# EAGLE design working (EAGLE 9.6.2)
COMPANY: ADAFRUIT INDUSTRIES; DRAWN: KTOWN; REV: A
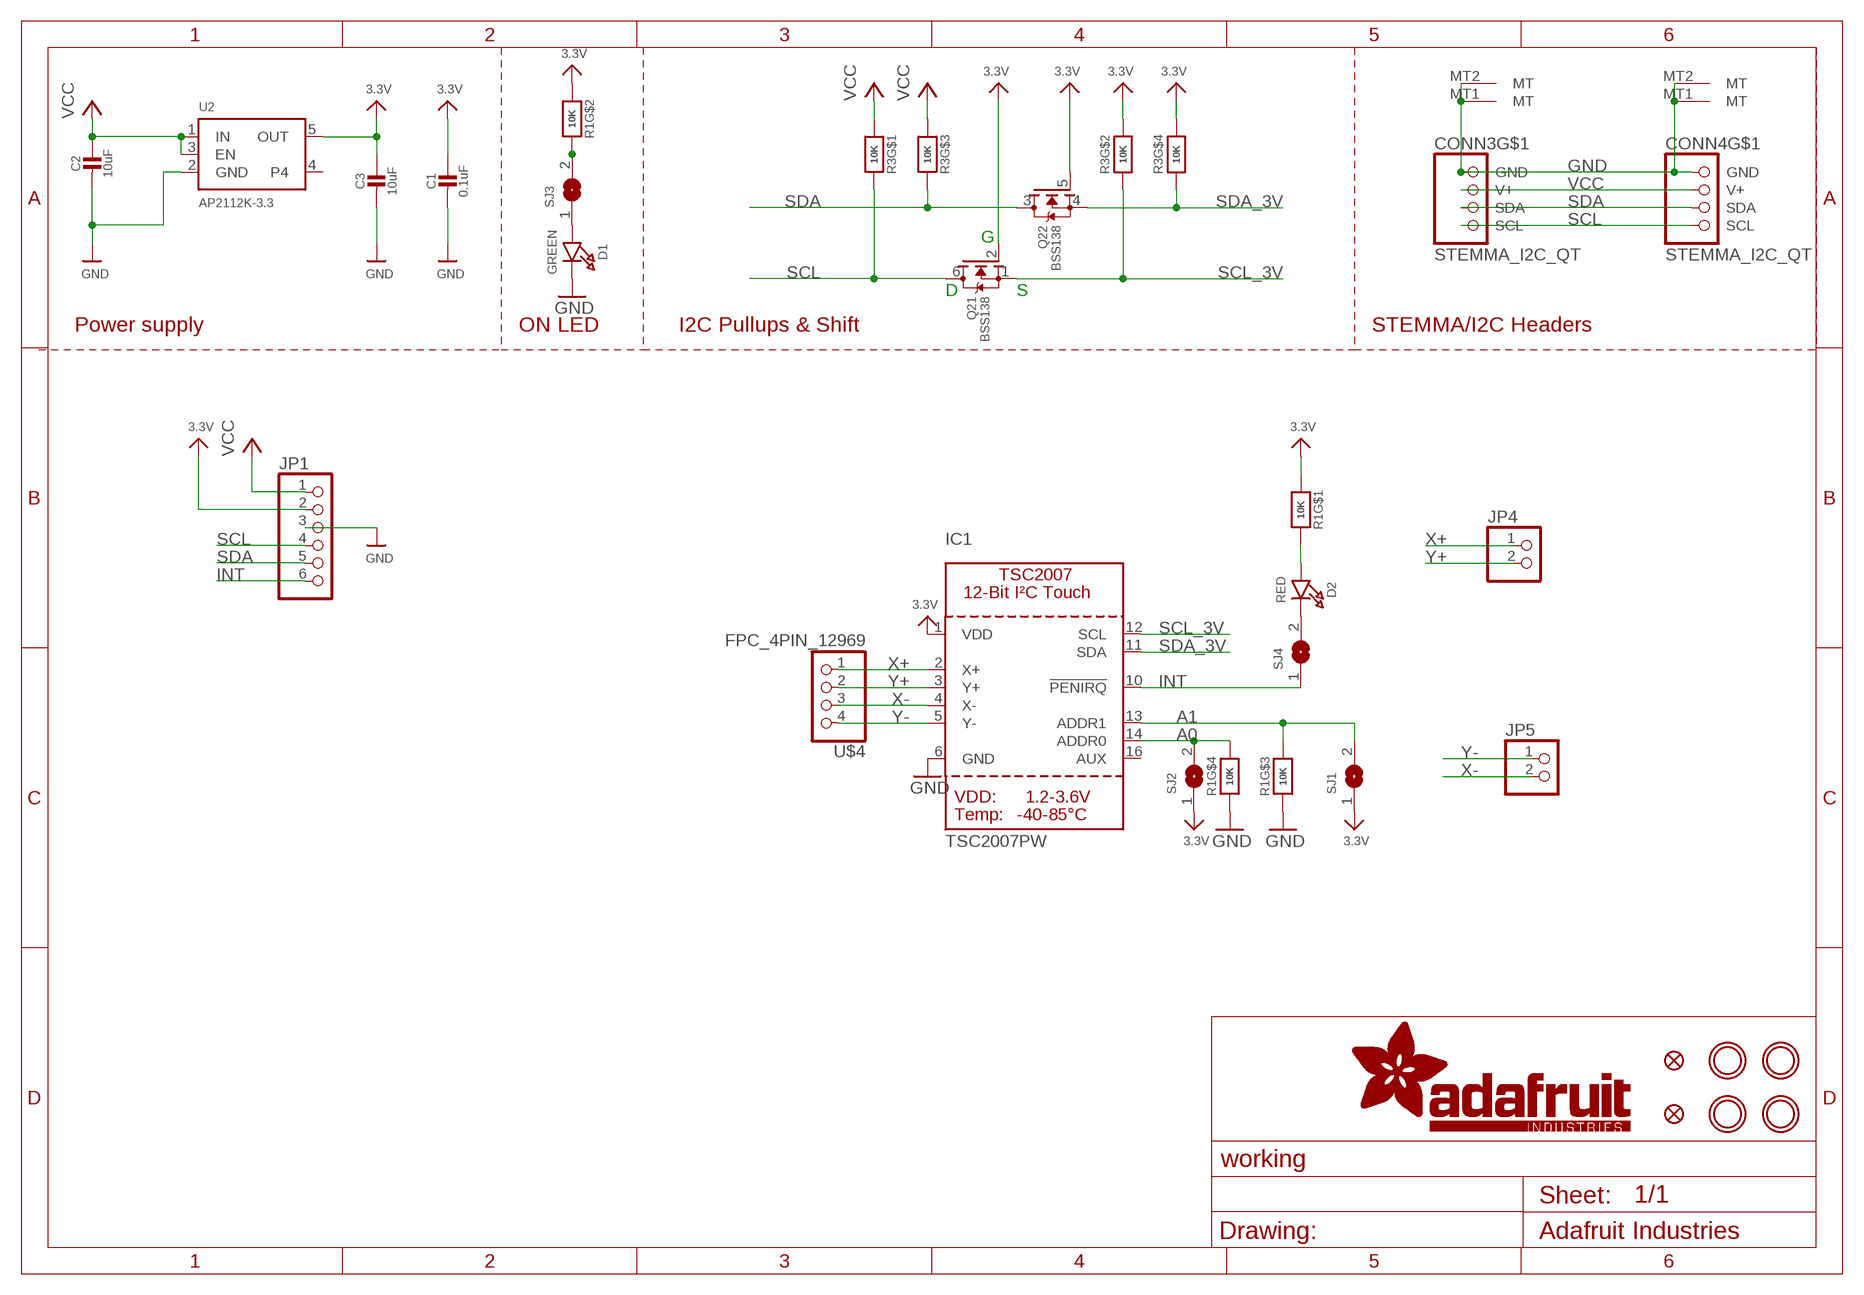
[diagram p0: schematic, sheet 1]

## Parts
C1  0.1uF  CAP_CERAMIC0603_NO  [0603-NO]
C2  10uF  CAP_CERAMIC0805-NOOUTLINE  [0805-NO]
C3  10uF  CAP_CERAMIC0805-NOOUTLINE  [0805-NO]
CONN3  STEMMA_I2C_QT  [JST_SH4]
CONN4  STEMMA_I2C_QT  [JST_SH4]
D1  GREEN  LED0603_NOOUTLINE  [CHIPLED_0603_NOOUTLINE]
D2  RED  LED0603_NOOUTLINE  [CHIPLED_0603_NOOUTLINE]
FID3  FIDUCIAL_1MM  [FIDUCIAL_1MM]
FID4  FIDUCIAL_1MM  [FIDUCIAL_1MM]
IC1  TSC2007PW  [TSSOP16]
JP1  HEADER-1X670MIL  [1X06_ROUND_70]
JP4  HEADER-1X2ROUND  [1X02_ROUND]
JP5  HEADER-1X2ROUND  [1X02_ROUND]
Q2  BSS138  MOSFET-N_DUAL  [SOT363]
R1  10K  RESISTOR_4PACK  [RESPACK_4X0603]
R3  10K  RESISTOR_4PACK  [RESPACK_4X0603]
SJ1  SOLDERJUMPER  [SOLDERJUMPER_ARROW_NOPASTE]
SJ2  SOLDERJUMPER  [SOLDERJUMPER_ARROW_NOPASTE]
SJ3  SOLDERJUMPERCLOSED  [SOLDERJUMPER_CLOSEDWIRE]
SJ4  SOLDERJUMPERCLOSED  [SOLDERJUMPER_CLOSEDWIRE]
U2  AP2112K-3.3  VREG_SOT23-5  [SOT23-5]
U$1  MOUNTINGHOLE2.5  [MOUNTINGHOLE_2.5_PLATED]
U$4  FPC_4PIN_12969  [FPC_CONN_1MM_DUAL_4P]
U$17  MOUNTINGHOLE2.5  [MOUNTINGHOLE_2.5_PLATED]
U$19  MOUNTINGHOLE2.5  [MOUNTINGHOLE_2.5_PLATED]
U$21  MOUNTINGHOLE2.5  [MOUNTINGHOLE_2.5_PLATED]

## Nets
3.3V [lowpower]: C1.1 C3.1 IC1.1(VDD) JP1.2 Q2.2(1:G) Q2.5(2:G) R1.1 R1.2 R3.2 R3.4 SJ1.1 SJ2.1 U2.5(OUT)
A0: IC1.14(ADDR0) R1.5 SJ2.2
A1: IC1.13(ADDR1) R1.6 SJ1.2
GND [highpower]: C1.2 C2.2 C3.2 CONN3.1(GND) CONN3.MT1(MT) CONN3.MT2(MT) CONN4.1(GND) CONN4.MT1(MT) CONN4.MT2(MT) D1.C IC1.6(GND) JP1.3 R1.3 R1.4 U2.2(GND)
INT: IC1.10(!PENIRQ) JP1.6 SJ4.1
N$1: R1.7 SJ3.2
N$2: D1.A SJ3.1
N$3: D2.A R1.8
N$4: D2.C SJ4.2
SCL: CONN3.4(SCL) CONN4.4(SCL) JP1.4 Q2.6(1:D) R3.8
SCL_3V: IC1.12(SCL) Q2.1(1:S) R3.7
SDA: CONN3.3(SDA) CONN4.3(SDA) JP1.5 Q2.3(2:D) R3.6
SDA_3V: IC1.11(SDA) Q2.4(2:S) R3.5
VCC [highpower]: C2.1 CONN3.2(V+) CONN4.2(V+) JP1.1 R3.1 R3.3 U2.1(IN) U2.3(EN)
X+: IC1.2(X+) JP4.1 U$4.1
X-: IC1.4(X-) JP5.2 U$4.3
Y+: IC1.3(Y+) JP4.2 U$4.2
Y-: IC1.5(Y-) JP5.1 U$4.4
Unconnected: IC1.16(AUX) U2.4

## Notes on the sheet
- G
- D | S
- Power supply | ON LED | I2C Pullups & Shift | STEMMA/I2C Headers

## Library data of the parts
C1-C3 = microbuilder:CAP_CERAMIC: Ceramic Capacitors For new designs, use the packages preceded by an '_' character since they are more reliable: The following footprints should be used on most boards: _0402 - Standard footprint for regular board layouts _0603 - Standard footprint for regular board layouts _0805 - Standard footprint for regular board layouts _1206 - Standard footprint for regular board layouts For extremely tight-pitch boards where space is at a premium, the following 'micro-pitch' footprints can be used (smaller pads, no silkscreen outline, etc.): _0402MP - Micro-pitch footprint for very dense/compact boards _0603MP - Micro-pitch footprint for very dense/compact boards _0805MP - Micro-pitch footprint for very dense/compact boards _1206MP - Micro-pitch footprint for very dense/compact boards
CONN3 CONN4 = microbuilder:STEMMA_I2C
D1 D2 = microbuilder:LED: LED 0603 - 0603 Surface Mount Package 2mA: Green LED - Low Power (3.9mcd, 2ma, 1.7Vf) - Digikey: 475-2709-2-ND Orange LED - Low Power (9.8mcd, 2ma, 1.8Vf) - Digikey: 475-1194-2-ND Red LED - Low Power (5mcd, 2ma, 1.8Vf) - Digikey: 475-1195-2-ND Yellow LED - Low Power (7mcd, 2ma, 1.8Vf) - Digikey: 475-1196-2-ND 5mA: Blue LED - Low Power (17mcd, 5ma, 2.9Vf) - Digikey: LNJ937W8CRACT-ND 0805 - 0805 Surface Mount Package 2mA: Red LED (8.8mcd, 2mA, 1.8Vf, Clear) - Low Power [Digikey: 475-2510-1-ND] Green LED (5mcd, 2mA, 1.8Vf, Clear) - Low Power [Digikey: 475-2730-1-ND] Yellow LED (11.3mcd, 2mA, 1.8Vf, Clear) - Low Power [Digikey: 475-2555-1-ND] 20mA: Red LED (104mcd, 20mA, Diffused) - LS R976 [Digikey: 475-1278-6-ND] Red LED (12mcd, 20mA, 2.0Vf, Clear) - APT2012EC [Digikey: 754-1128-1-ND] Green LED (15mcd, 20mA, 2.2Vf, Clear) - APT2012GC [Digikey: 754-1131-1-ND] Orange LED (160mcd, 20mA, 2.1Vf, Clear) - APT2012SECK [Digikey: 754-1130-1-ND] 1206 - 1206 Surface Mount Package Green LED (26mcd, 20mA, Diffused) - LG N971 [Digikey: 475-1407-6-ND] Red LED (15mcd, 20mA, Diffused) - LH N974 [Digikey: 475-1416-6-ND] Cree - Cree High-Power Surface Mount LEDs XPEBWT-L1-0000-00D50 - White 111lm 350mA 2.9Vf 6200K 110° XTEAWT-00-0000-00000LEE3 - White 114lm 350mA 2.85Vf 5000K 115° Everlight - Everlight 45-21 Series Surface Mount LEDs 45-21/QK2C-B2832AC2CB2/2T - Warm White 2000mcd 20mA 3.25Vf 3050K 120° 45-21/LK2C-B38452C4CB2/2T - Nuetral White 2000mcd 20mA 3.25Vf 4150K 120° 45-21/LK2C-B50634C6CB2/2T - Cold White 2200mcd 20mA 3.25Vf 5650K 120° PLCC2 Reverse Mount LS T77K-J1L2-1-0-2-R18-Z - Red 11.25mcd 2mA 1.8Vf 630nm 120° LO T77K-L1M2-24-Z - Orange 19.6mcd 2mA 1.8Vf 606nm 120° LY T77K-K2M1-26-Z - Yellow 15.7mcd 2mA 1.8Vf 587nm 120°
FID3 FID4 = microbuilder:FIDUCIAL: Fiducial Alignment Points Various fiducial points for machine vision alignment.; BOM: EXCLUDE
IC1 = adafruit_sensor:TSC2007
JP1 = microbuilder:HEADER-1X6: PIN HEADER
JP4 JP5 = microbuilder:HEADER-1X2: PIN HEADER
Q2 = microbuilder:MOSFET-N_DUAL: Dual N-Channel MOSFET SOT363 (2.0x1.25mm) 2N7002PS - 60V, 320mA [Digikey: 568-5984-1-ND]
R1 R3 = microbuilder:RESISTOR_4PACK: Resistor Packs (4 resistors) 4 x 0603 10K 1/16W - Digikey: YC164J-10KCT-ND
SJ1 SJ2 = microbuilder:SOLDERJUMPER: SMD Solder JUMPER Solder the two pads together to create a connection, or remove the solder to break it. REFLOW - Use this footprint for solder paste and reflow ovens. WAVE - Use this footprint for hand-soldering (larger pads). CLOSED - Has a trace between the two pads to ensure it is closed by default. The trace needs to be cut to disable the jumper, and can be closed again by creating a solder bridge between the two pads.; BOM: EXCLUDE
SJ3 SJ4 = microbuilder:SOLDERJUMPER: SMD Solder JUMPER Solder the two pads together to create a connection, or remove the solder to break it. REFLOW - Use this footprint for solder paste and reflow ovens. WAVE - Use this footprint for hand-soldering (larger pads). CLOSED - Has a trace between the two pads to ensure it is closed by default. The trace needs to be cut to disable the jumper, and can be closed again by creating a solder bridge between the two pads.
U2 = adafruit_power:VREG_SOT23-5: SOT23-5 Fixed Voltage Regulators Part Current Out V Out V In V Dropout θJA (°C/W) TJ (°C) Digikey Part No. ADP121 150mA 3.3V 3.4-5.5V 0.09V @ 150mA -- -- ADP121-AUJZ33R7CT-ND ADP121 150mA 3.0V 3.1-5.5V 0.09V @ 150mA -- -- ADP121-AUJZ30R7CT-ND ADP122 300mA 3.3V 3.4-5.5V 0.085V @ 300mA -- -- ADP122AUJZ-3.3-R7CT-ND ADP1712 300mA 3.3V 3.5-5.5V 0.17V @ 300mA -- -- ADP1712AUJZ-3.3-R7TR-ND AP7311 (Low Cost) 150mA 3.3V 3.5-6V 0.15V @ 150mA -- -- AP7311-33WG-7DICT-ND LD39015M18R 150mA 1.8V 1.9V-5.5V 0.08V @ 100mA -- -- 497-6977-1-ND LP2985A-33DBVR 150mA 3.3V 3.3-16V 0.28V @ 150mA 206 150 296-18479-1-ND MCP1824T-3302E/OT 300mA 3.3V 3.5V-6V 0.2V @ 300mA -- -- MCP1824T-3302E/OTCT-ND MIC5205-2.5YM5 TR 150mA 2.5V 2.7-16V 0.165V @ 150mA -- -- 576-1257-2-ND MIC5205-3.0YM5 TR 150mA 3.0V 3.2V-16V 0.165V @ 150mA -- -- 576-1258-2-ND MIC5205-3.3YM5 TR 150mA 3.3V 3.5V-16V 0.165V @ 150mA -- -- 576-1259-2-ND TPS780330220 150mA 3.3V+2.2V 3.6-5.5V 250mV Max -- -- 296-23332-1-ND TDA3663/N1,135 100mA 3.3V 3.5-45V 0.18V @ 50mA -- -- 568-5343-1-ND Max operating temp can be calculated using θJA, TJ (max junction temperature), and power in watts. Set the "Maximum Ambient Temperature" until it reaches TJ ("Max Junction Temperature"), which is the absolute limit for safe use of the regulator: Heat Sink Temperature Calculator <http://www.daycounter.com/Calculators/Heat-Sink-Temperature-Calculator.phtml> For example, With 12V source into a 3.3V LP2985 and a 30mA load, we are dissipating (12V-3.3V) * 0.03A = 0.261W. With a θJA of 206 °C/W, a TJ of 150°C, and 261mW we can safely use the chip without a heat sink up to 75°C (=147.1°C Junction Temperature).
U$1 U$17 U$19 U$21 = adafruit_electromech:MOUNTINGHOLE: Mounting Hole For #2 screws (0.086"/2.18mm width, 0.094"/2.4mm hole) use 2.5mm; BOM: EXCLUDE
U$4 = microbuilder:FPC_4PIN

## Net classes
1 highpower: width 0.305 mm, drill 0.483 mm
2 lowpower: width 0.254 mm, drill 0.483 mm

## Board
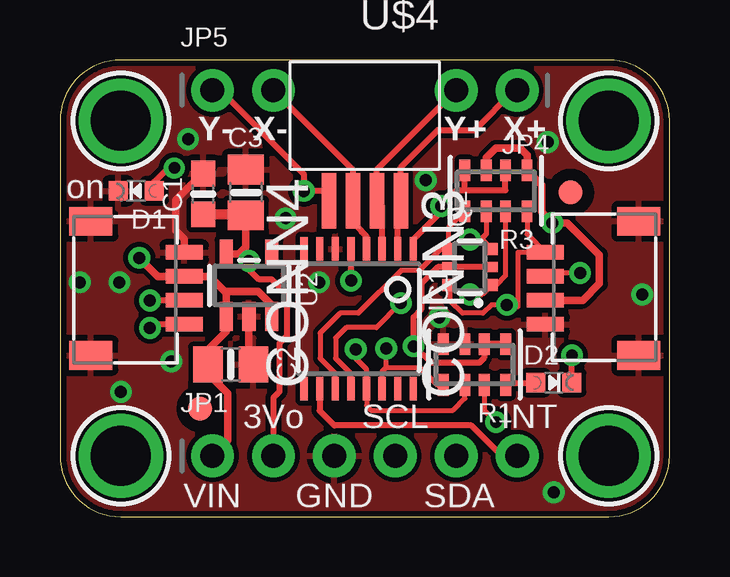
[diagram p1: board, top side]
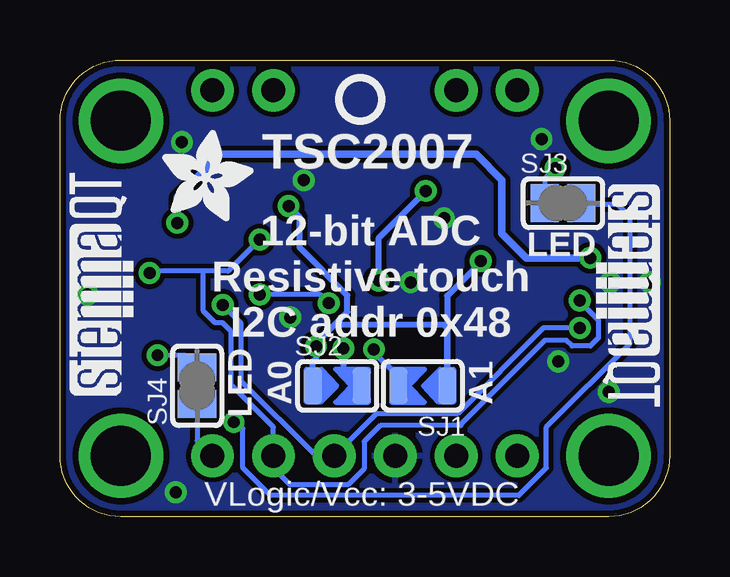
[diagram p2: board, bottom side, seen from below]

Size 25.4 x 19.05 mm. Coordinates in mm from the lower left corner, seen from the top.
Outline: 0,16.51 0,2.54 arc90 2.54,0 22.86,0 arc90 25.4,2.54 25.4,16.51 arc90 22.86,19.05 2.54,19.05 arc90 0,16.51
Copper layers (1*16): Top 0.035mm / dielectric 1.5mm / Bottom 0.035mm
Design rules "adafruit *": minimum track width 8mil, minimum drill 15.5mil, track to track 8mil, track to pad 8mil, pad to pad 8mil, via to via 8mil, smd to smd 8mil, copper to edge 10mil, drill to drill 8mil, minimum pad ring 10mil, minimum via ring 8mil, stop-mask expansion 2mil, vias tented up to drill 20mil, thermal gap 10mil

### Footprints (pad centres in the part's own frame; a part is rotated, then mirrored left to right if it is on the bottom)
0603-NO = smd 1.075 x 1: 1 -0.85,0; 2 0.85,0
0805-NO = smd 1.24 x 1.5: 1 -0.95,0; 2 0.95,0
JST_SH4 = smd 0.6 x 1.55: 1 -1.5,2.514; 2 -0.5,2.514; 3 0.5,2.514; 4 1.5,2.514 | smd 1.2 x 1.8: MT1 -2.8,-1.386; MT2 2.8,-1.386
CHIPLED_0603_NOOUTLINE = smd 0.8 x 0.8: A 0,-0.75; C 0,0.75
FIDUCIAL_1MM = smd 1 x 1: 1 0,0
TSSOP16 = smd 0.305 x 0.991: 1 -2.275,-2.918; 2 -1.625,-2.918; 3 -0.975,-2.918; 4 -0.325,-2.918; 5 0.325,-2.918; 6 0.975,-2.918; 7 1.625,-2.918; 8 2.275,-2.918; 9 2.275,2.918; 10 1.625,2.918; 11 0.975,2.918; 12 0.325,2.918; 13 -0.325,2.918; 14 -0.975,2.918; 15 -1.625,2.918; 16 -2.275,2.918
1X06_ROUND_70 = drill 1 pad 1.778: 1 -6.35,0; 2 -3.81,0; 3 -1.27,0; 4 1.27,0; 5 3.81,0; 6 6.35,0
1X02_ROUND = drill 1 pad 1.778: 1 -1.27,0; 2 1.27,0
SOT363 = smd 0.5 x 0.5: 1 -0.75,-0.9; 3 0.75,-0.9; 4 0.75,0.9; 6 -0.75,0.9 | smd 0.4 x 0.5: 2 0,-0.9; 5 0,0.9
RESPACK_4X0603 = smd 0.45 x 0.9: 1 -1.3,-0.85; 2 -0.4,-0.85; 3 0.4,-0.85; 4 1.3,-0.85; 5 1.3,0.85; 6 0.4,0.85; 7 -0.4,0.85; 8 -1.3,0.85
SOLDERJUMPER_ARROW_NOPASTE = smd 0.762 x 1.524: 1 -1.016,0; 2 1.016,0
SOLDERJUMPER_CLOSEDWIRE = smd 1.168 x 1.6: 1 -0.762,0; 2 0.762,0 | smd 0.635 x 0.203: WIRE 0,0
SOT23-5 = smd 0.55 x 1.2: 1 -0.95,-1.3; 2 0,-1.3; 3 0.95,-1.3; 4 0.95,1.3; 5 -0.95,1.3
MOUNTINGHOLE_2.5_PLATED = drill 2.5 pad 3.2: P$1 0,0
FPC_CONN_1MM_DUAL_4P = smd 0.6 x 2.3: 1 -1.5,1.3; 2 -0.5,1.3; 3 0.5,1.3; 4 1.5,1.3

### Placement (x,y rotation side)
C1  5.97,13.46 90 top
C2  7.11,6.35 0 top
C3  7.75,13.53 90 top
CONN3  22.73,9.53 90 top
CONN4  2.67,9.53 270 top
D1  3.17,13.59 90 top
D2  20.57,5.59 270 top
FID3  5.84,4.51 0 top
FID4  21.27,13.53 0 top
IC1  12.45,8.26 180 top
JP1  12.7,2.54 0 top
JP4  17.78,17.78 180 top
JP5  7.62,17.78 0 top
Q2  17.08,10.41 90 top
R1  17.27,6.35 180 top
R3  18.16,13.59 180 top
SJ1  10.29,5.46 180 bottom
SJ2  13.84,5.46 0 bottom
SJ3  4.45,13.08 0 bottom
SJ4  19.68,5.46 90 bottom
U2  7.87,9.65 0 top
U$1  2.54,16.51 0 top
U$4  12.7,14.48 180 top
U$12  [ADAFRUIT_3.5MM]  21.15,12.32 0 bottom
U$17  22.86,16.51 0 top
U$19  2.54,2.54 0 top
U$21  22.86,2.54 0 top
U$25  [PCBFEAT-REV-040]  12.89,17.4 0 bottom
U$30  [STEMMAQT]  22.35,5.08 90 bottom
U$31  [STEMMAQT]  3.05,13.84 270 bottom

### Tracks (layer width: path | path; a pad name or v marks a point on that pad's centre or on a via)
3.3V  (via drill 0.5)
  Top 0.254: R3.2 18.56,13.62 16.86,13.62 | Q2.2 Q2.5 15.75,10.41 15.05,9.72 15.05,8.64 14.73,8.32 v14.73,7.11 14.79,7.11 15.48,6.42 17.47,6.42 17.67,6.62 R1.2 R1.1 | C3.1 7.75,10.79 v7.87,10.67 7.87,10.31 8.29,9.89 8.81,9.89 9.46,9.25 9.46,7.56 9.14,7.23 9.14,5.21 8.89,4.96 JP1.2 | IC1.1 14.72,11.55 16,12.83 v15.88,12.95 15.88,12.96 16.53,13.62 16.86,13.62 | 16.86,13.62 R3.4
  Top 0.305: U2.5 7.46,10.95 7.75,11.24 C3.1
  Top 0.406: C3.1 7.71,12.61 C1.1
  Bottom 0.254: SJ2.1 14.86,6.48 14.73,6.6 v14.73,7.11 14.73,7.24 13.97,8 | v15.88,12.95 15.43,12.51 15.43,11.24 13.42,9.23 13.42,8.55 13.97,8 | v7.87,10.67 7.87,10.6 9.27,9.21 SJ1.1 9.27,7.87 9.4,8 13.97,8
A0  (via drill 0.5)
  Top 0.203: IC1.14 13.42,6.05 13.59,6.22 | 13.59,6.22 14.99,6.22 15.71,5.5 R1.5 | 13.59,6.22 v13.59,7.02
  Bottom 0.254: v13.59,7.02 13.59,6.22 SJ2.2
A1  (via drill 0.5)
  Top 0.203: v12.32,6.99 12.32,6.6 12.77,6.15 IC1.13 12.77,4.63 12.95,4.45 16.38,4.45 16.87,4.93 R1.6
  Bottom 0.254: v12.32,6.99 12.32,6.86 11.3,5.84 SJ1.2
GND  (via drill 0.5)
  Top 0.305: 19.91,8 19.86,8 19.89,8.03 CONN3.1 | U2.2 7.87,6.54 C2.2 | C1.2 5.93,14.31 4.83,13.21 4.83,11.94 5.18,11.58 CONN4.1
  other vias: 24.26,9.27 0.83,9.78 10.79,9.78 9.4,12.45 5.33,15.75 20.32,15.62 20.57,1.02 2.54,5.21 15.24,14.03 15.81,8.32 2.48,9.78 4.64,6.48
  pour Top: 0,19.05 25.4,19.05 25.4,0 0,0
  pour Bottom: 0,19.05 25.4,19.05 25.4,0 0,0
INT
  Top 0.254: IC1.10 10.82,4.42 11.43,3.81 17.14,3.81 18.41,2.54 JP1.6
  Bottom 0.203: SJ4.1 19.68,3.17 JP1.6
N$1  (via drill 0.48)
  Top 0.203: R1.7 17.67,4.44 v18.16,3.95
  Bottom 0.203: SJ3.2 3.56,12.95 3.49,13.02 2.16,13.02 1.65,12.51 1.65,7.23 5.13,3.75 5.13,2.04 6.28,0.89 16.64,0.89 17.78,2.03 17.78,3.68 18.05,3.95
  Bottom 0.254: v18.16,3.95 18.05,3.95
N$2  (via drill 0.48)
  Top 0.254: D1.A 3.92,13.96 4.51,14.54 v4.76,14.54
  Bottom 0.203: v4.76,14.54 5.21,14.1 SJ3.1
N$3
  Top 0.254: R1.8 18.66,5.59 D2.A
N$4  (via drill 0.48)
  Top 0.254: D2.C 21.32,6.72 v21.34,6.73
  Bottom 0.203: SJ4.2 20.19,6.73 v21.34,6.73
SCL  (via drill 0.5)
  Top 0.203: Q2.6 16.25,9.6 16.25,9.02 16.77,8.49 17.63,8.49 17.99,8.84 v18.62,8.84 18.7,8.76 19.08,8.76 19.08,11.03 CONN3.4 19.46,11.78 R3.8
  Top 0.254: CONN4.4 3.9,8.03 v3.75,7.87
  Bottom 0.203: v3.75,7.87 5.26,7.87 8.81,4.32 12.19,4.32 JP1.4 14.73,2.54 17.86,5.67 17.86,8.08 v18.62,8.84
SCL_3V  (via drill 0.5)
  Top 0.203: 12.12,5.97 11.49,6.61 11.49,7.46 11.92,7.89 13.19,7.89 v14.21,8.91 | v17.08,9.27 17.59,9.27 Q2.1 18.17,9.66 18.56,10.05 R3.7
  Top 0.254: IC1.12 12.12,5.97
  Bottom 0.203: v17.08,9.27 17.06,9.29 14.59,9.29 v14.21,8.91
SDA  (via drill 0.5)
  Top 0.203: Q2.3 17.59,11.56 v17.08,11.56 17.53,11.56 17.76,11.79 R3.6 | v21.67,10.16 20.73,10.16
  Top 0.254: 20.73,10.16 20.6,10.03 CONN3.3 | CONN4.3 v3.75,9.03 v3.75,9.02
  Bottom 0.203: v3.75,9.02 3.75,8.98 2.96,8.2 2.96,7.45 3.3,7.12 4.06,7.12 4.3,7.36 5.2,7.36 8.7,3.86 8.7,3.81 12.05,3.81 12.72,3.14 12.72,2.01 13.4,1.33 15.81,1.33 16.51,2.03 | v21.67,10.16 21.42,10.16 21.34,10.24 19.43,10.24 | v17.08,11.56 18.4,10.24 19.43,10.24 | 19.43,10.24 19.43,8.58 18.93,8.08 18.62,8.08 18.27,7.72 18.27,5.5 16.51,3.74 JP1.5
  Bottom 0.254: 16.51,2.03 JP1.5
SDA_3V
  Top 0.203: R3.5 16.18,12.06 Q2.4 15.86,11.16 14.97,10.28 14.21,10.28 12.44,8.5 11.67,8.5 10.84,7.66 10.84,6.61 11.47,5.97 IC1.11
VCC  (via drill 0.5)
  Top 0.305: JP1.1 6.99,3.18 6.99,5.14 6.16,5.97 C2.1 6.16,6.96 6.92,7.72 U2.1 6.92,9.34 | U2.3 8.82,8.83 8.26,9.4 6.99,9.4 6.92,9.34 | 6.92,9.34 6.24,10.03 CONN4.2 4.07,10.03 v3.3,10.79 | R3.3 17.76,14.97 18.16,15.37 19.18,15.37 19.46,15.08 R3.1 20.07,13.83 20.07,12.7 v20.51,12.26 21.14,12.26 22.48,10.92 22.48,9.72 21.78,9.03 CONN3.2
  Bottom 0.305: v3.3,10.79 5.97,10.79 6.99,11.81 6.99,14.03 8.06,15.11 18.73,15.11 20.51,13.33 v20.51,12.26
X+
  Top 0.254: IC1.2 14.07,13.05 U$4.1 14.2,14.58 15.75,16.13 17.27,16.13 18.92,17.78 JP4.1
X-
  Top 0.254: IC1.4 12.77,11.69 12.57,11.89 12.57,11.92 12.2,12.29 U$4.3 12.2,14.47 JP5.2
Y+
  Top 0.254: IC1.3 13.42,12.96 U$4.2 13.2,14.47 JP4.2
Y-  (via drill 0.5)
  Top 0.254: IC1.5 v12.12,9.85 v12.13,9.84 | U$4.4 11.18,13.18 11.18,13.59 v10.16,13.59 10.16,14.29 6.67,17.78 JP5.1
  Bottom 0.254: v12.13,9.84 12.13,11.62 v10.16,13.59

### Text on the board
tPlace: Y- | X- | Y+ | X+ | on | 3Vo | SCL | INT | VIN | GND | SDA
bPlace: TSC2007 | LED | 12-bit ADC / Resistive touch / I2C addr 0x48 | A1 | A0 | LED | VLogic/Vcc: 3-5VDC